# Altium schematic sheet Balun_And_Demodulation.SchDoc
size A4
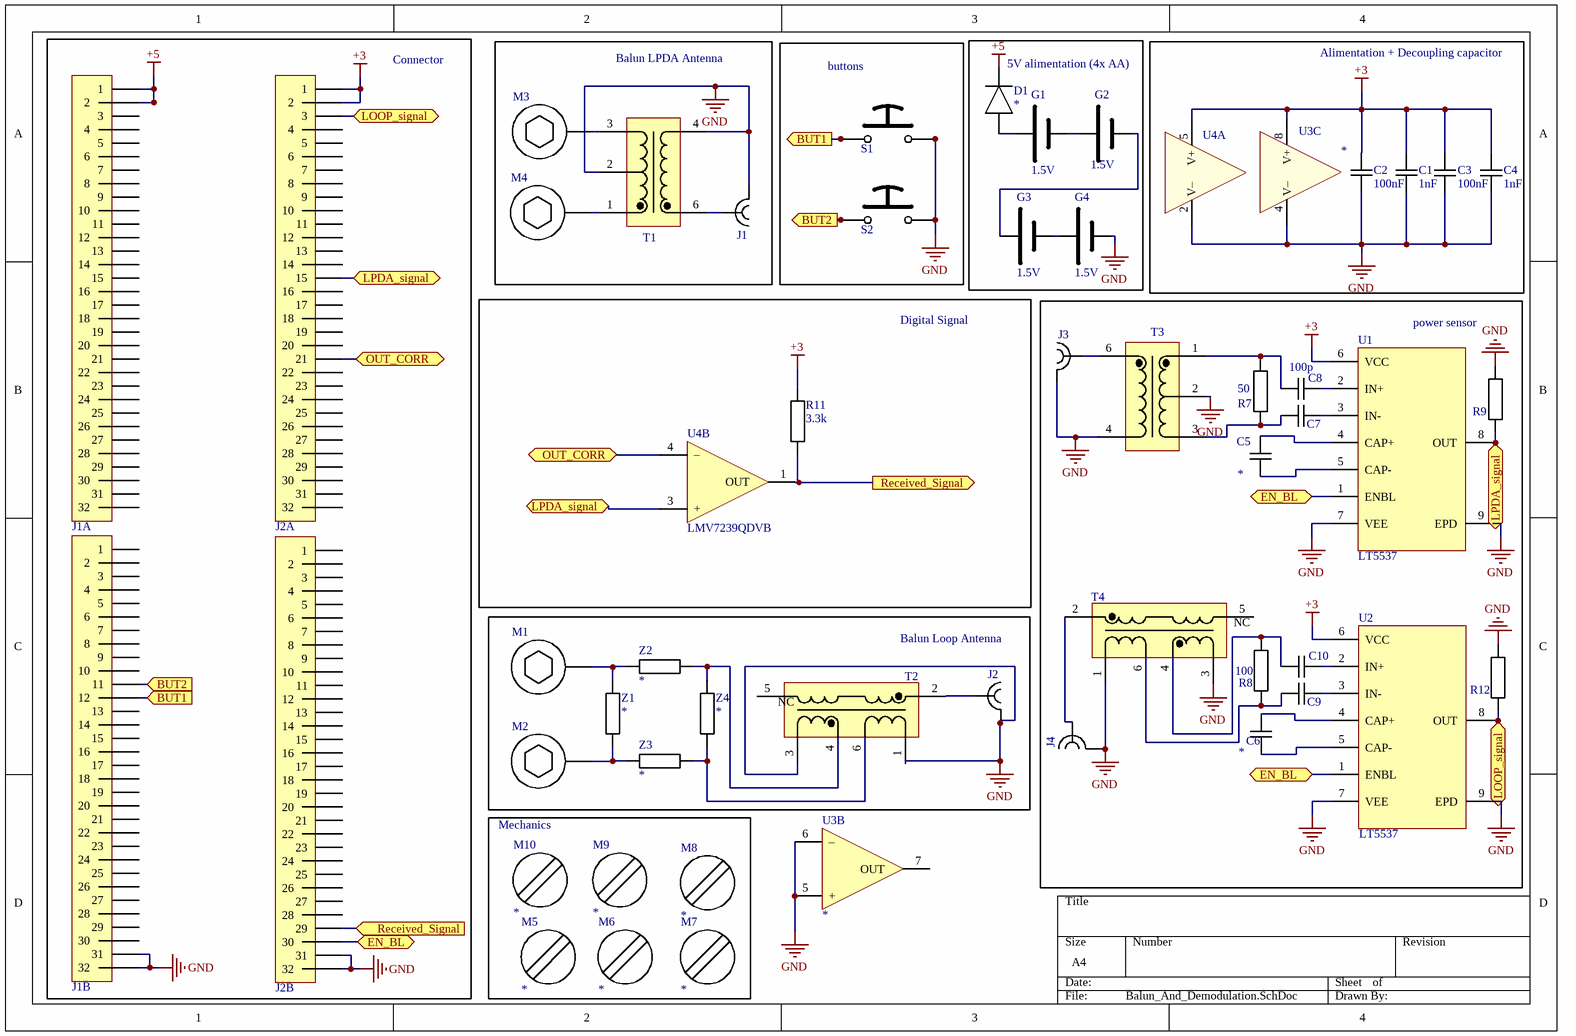
[diagram p0: Balun_And_Demodulation.SchDoc]

## Parts
C1  1nF  [CAPACITOR 2012 REFLOW]
C2  100nF  [CAPACITOR 2012 REFLOW]
C3  100nF  [CAPACITOR 2012 REFLOW]
C4  1nF  [CAPACITOR 2012 REFLOW]
C5  *  [CAPACITOR 2012 REFLOW]
C6  *  [CAPACITOR 2012 REFLOW]
C7  100p  [CAPACITOR 1005 REFLOW]  (value not drawn)
C8  100p  [CAPACITOR 1005 REFLOW]
C9  100p  [CAPACITOR 1005 REFLOW]  (value not drawn)
C10  100p  [CAPACITOR 1005 REFLOW]  (value not drawn)
D1  *  [DIODE DO35 P7.5]
G1  1.5V  [1.5V Cell AA/LR6]
G2  1.5V  [1.5V Cell AA/LR6]
G3  1.5V  [1.5V Cell AA/LR6]
G4  1.5V  [1.5V Cell AA/LR6]
J1  CONSMA001-G  [SMA TH Vertical Linx CONSMA001-G]  (value not drawn)
J1A  *  [PinHeader2x16 P2.54]  (value not drawn)
J1B  *  [PinHeader2x16 P2.54]  (value not drawn)
J2  CONSMA001-G  [SMA TH Vertical Linx CONSMA001-G]  (value not drawn)
J2A  *  [PinHeader2x16 P2.54]  (value not drawn)
J2B  *  [PinHeader2x16 P2.54]  (value not drawn)
J3  CONSMA001-G  [SMA TH Vertical Linx CONSMA001-G]  (value not drawn)
J4  CONSMA001-G  [SMA TH Vertical Linx CONSMA001-G]  (value not drawn)
M1  (no value)  [Screw Hex Socket M2.5X4 Connected]
M2  (no value)  [Screw Hex Socket M2.5X4 Connected]
M3  (no value)  [Screw Hex Socket M2.5X4 Connected]
M4  (no value)  [Screw Hex Socket M2.5X4 Connected]
M5  *  [Screw M3X12 Unconnected]
M6  *  [Screw M3X12 Unconnected]
M7  *  [Screw M3X12 Unconnected]
M8  *  [Screw M3X12 Unconnected]
M9  *  [Screw M3X12 Unconnected]
M10  *  [Screw M3X12 Unconnected]
R7  50  [RESISTOR 1005 REFLOW]
R8  100  [RESISTOR 1005 REFLOW]
R9  0  [RESISTOR 2012 REFLOW]  (value not drawn)
R11  3.3k  [RESISTOR 2012 REFLOW]
R12  0  [RESISTOR 2012 REFLOW]  (value not drawn)
S1  *  [Push Button C6.0x6.0 WE 430186130716]  (value not drawn)
S2  *  [Push Button C6.0x6.0 WE 430186130716]  (value not drawn)
T1  {Value}  [TC1-1TG2+]  (value not drawn)
T2  {Value}  [NCS2-771-75+]  (value not drawn)
T3  {Value}  [TC1-1TG2+]  (value not drawn)
T4  {Value}  [NCS2-771-75+]  (value not drawn)
U1  LT5537  [DFN8 P0.5 T0.6X1.2 C2.0X3.0 H0.8]
U2  LT5537  [DFN8 P0.5 T0.6X1.2 C2.0X3.0 H0.8]
U3  *  [DIP8 P2.54 W7.62 H5.0]  (parts B,C of 3)
U4  LMV7239QDVB  [SOT23-5 P0.95 C1.6x3.0 H1.3]  (value not drawn)  (parts A,B of 2)
Z1  *  [RESISTOR 2012 REFLOW]
Z2  *  [RESISTOR 2012 REFLOW]
Z3  *  [RESISTOR 2012 REFLOW]
Z4  *  [RESISTOR 2012 REFLOW]

## Blocks framed on the sheet
Connector: J1A J1B J2A J2B
Balun LPDA Antenna: J1 M3 M4 T1
buttons: S1 S2
5V alimentation (4x AA): D1 G1-G4
Alimentation + Decoupling capacitor: C1-C4 U3 U4
Digital Signal: R11 U4
power sensor: C5-C10 J3 J4 R7-R9 R12 T3 T4 U1 U2
Balun Loop Antenna: J2 M1 M2 T2 Z1-Z4
Mechanics: M5-M10

## Ports
BUT1 (in), BUT1 (out), BUT2 (in), BUT2 (out), EN_BL (bidir), LOOP_signal (bidir), LPDA_signal (bidir), OUT_CORR (bidir), Received_Signal (in), Received_Signal (out)

## Nets
+3: C1.2 C2.2 C3.2 C4.2 J2A.1 J2A.2 R11.2 U1.6(VCC) U2.6(VCC) U3.8(V+) U4.5(V+)
+5: D1.1(C) J1A.1 J1A.2
GND: C1.1 C2.1 C3.1 C4.1 G4.2(—) J1.2 J1B.31 J1B.32 J2.2 J2B.31 J2B.32 J3.2 J4.2 R9.1 R12.1 S1.3 S1.4 S2.3 S2.4 T1.2 T1.4 T2.1 T2.3 T3.2 T3.4 T4.1 T4.3 U1.7(VEE) U1.9(EPD) U2.7(VEE) U2.9(EPD) U3.4(V–) U3.5(+) U3.6(–) U4.2(V–)
BUT1: J1B.12 S1.1 S1.2 ; port BUT1
BUT2: J1B.11 S2.1 S2.2 ; port BUT2
EN_BL: J2B.30 U1.1(ENBL) U2.1(ENBL) ; port EN_BL
LOOP_signal: J2A.3 R12.2 U2.8(OUT) ; port LOOP_signal
LPDA_signal: J2A.15 R9.2 U1.8(OUT) U4.3(+) ; port LPDA_signal
OUT_CORR: J2A.21 U4.4(–) ; port OUT_CORR
Received_Signal: J2B.29 R11.1 U4.1(OUT) ; port Received_Signal
NetC5_1: C5.1 U1.5(CAP-)
NetC5_2: C5.2 U1.4(CAP+)
NetC6_1: C6.1 U2.5(CAP-)
NetC6_2: C6.2 U2.4(CAP+)
NetC7_1: C7.1 U1.3(IN-)
NetC7_2: C7.2 R7.2 T3.3
NetC8_1: C8.1 U1.2(IN+)
NetC8_2: C8.2 R7.1 T3.1
NetC9_1: C9.1 U2.3(IN-)
NetC9_2: C9.2 R8.2 T4.6
NetC10_1: C10.1 U2.2(IN+)
NetC10_2: C10.2 R8.1 T4.4
NetD1_2: D1.2(A) G1.1(+)
NetG1_2: G1.2(—) G2.1(+)
NetG2_2: G2.2(—) G3.1(+)
NetG3_2: G3.2(—) G4.1(+)
NetJ1_1: J1.1 T1.6
NetJ2_1: J2.1 T2.2
NetJ3_1: J3.1 T3.6
NetJ4_1: J4.1 T4.2
NetM1_1: M1.1 Z1.2 Z2.1
NetM2_1: M2.1 Z1.1 Z3.1
NetM3_1: M3.1 T1.3
NetM4_1: M4.1 T1.1
NetT2_4: T2.4 Z2.2 Z4.2
NetT2_6: T2.6 Z3.2 Z4.1

Not connected (* = marked no-connect by the designer): J1A 3 4 5 6 7 8 9 10 11 12 13 14 15 16 17 18 19 20 21 22 23 24 25 26 27 28 29 30 31 32; J1B 1 2 3 4 5 6 7 8 9 10 13 14 15 16 17 18 19 20 21 22 23 24 25 26 27 28 29 30; J2A 4 5 6 7 8 9 10 11 12 13 14 16 17 18 19 20 22 23 24 25 26 27 28 29 30 31 32; J2B 1 2 3 4 5 6 7 8 9 10 11 12 13 14 15 16 17 18 19 20 21 22 23 24 25 26 27 28; T2 5; T4 5; U3 7(OUT)

## Notes on the sheet
- (in symbol NCS2-771-75+) NC

## Library data of the parts
C1-C10 = Capacitor
  C1 C4: Value: 1nF
  C2 C3: Value: 100nF
  C5 C6: Value: *
  C7-C10: Value: 100p
D1 = DIODE: Diode generic 2 leads; Value: *
G1-G4 = Battery: Battery Generic; Value: 1.5V
J1-J4 = SMA TH VERTICAL LINX CONSMA001-G: Value: CONSMA001-G
J1A J1B J2A J2B = PinHeader2x16: Plug connector; Value: *
M1-M4 = Screw Hex Socket Connected: Screw Hex Socket Connected BN610
M5-M10 = Screw Unconnected: Screw Unconnected BN330; Value: *
R7-R9 R11 R12 Z1-Z4 = Resistor
  R7: Value: 50
  R8: Value: 100
  R9 R12: Value: 0
  R11: Value: 3.3k
  Z1-Z4: Value: *
S1 S2 = Push Button 4Pins: Push Button, 4 pins, 2 poles parrallèle; pin to pad: 2>3 3>2; Value: *
T1 T3 = TC1-1TG2+: Mini-Circuits RF Transformer; Value: {Value}
T2 T4 = NCS2-771-75+: Mini-Circuits RF Transformer; Value: {Value}
U1 U2 = LT5537: Wide Dynamic Range RF/IF Log Detector; Value: LT5537
U3 = OPA DUAL: Generic dual OPA 8 pins; Value: *
U4 = COMPARATOR SINGLE SOT23-5: Generic Single Comparator 5pins 1OUT/2-V/3+IN/4-IN/5+V; Value: LMV7239QDVB